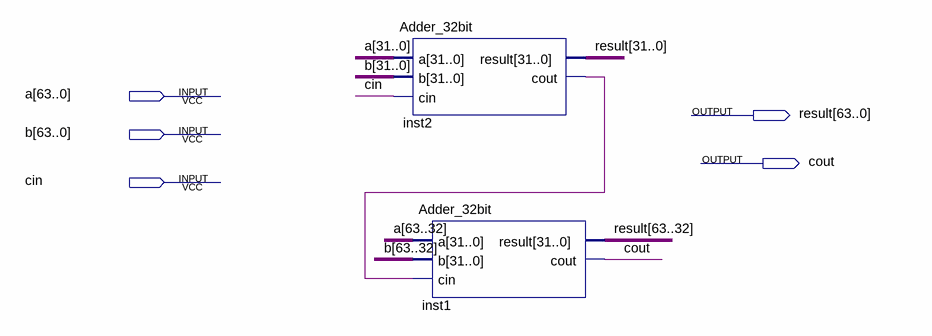
[diagram p0: schematic sheet]
// Quartus schematic Adder_64bit.bdf as structural Verilog: 2 symbols, 5 pins
module Adder_64bit (
  input  [63:0] a,
  input  [63:0] b,
  input  cin,
  output [63:0] result,
  output cout
);

  wire inst2_cout;

  Adder_32bit inst2 (.a(a[31:0]), .b(b[31:0]), .cin(cin), .result(result[31:0]), .cout(inst2_cout));
  Adder_32bit inst1 (.a(a[63:32]), .b(b[63:32]), .cin(inst2_cout), .result(result[63:32]), .cout(cout));
endmodule
